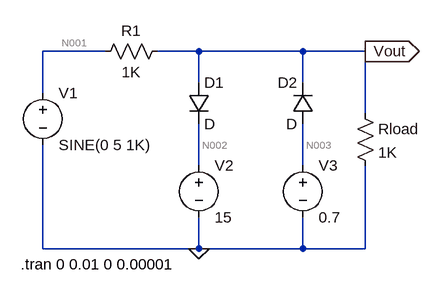
[diagram p0: schematic Draft2.asc]
Draft2.asc, the LTspice schematic file:
Version 4
SHEET 1 880 680
WIRE 288 80 192 80
WIRE 432 80 368 80
WIRE 592 80 432 80
WIRE 688 80 592 80
WIRE 432 128 432 80
WIRE 592 128 592 80
WIRE 192 144 192 80
WIRE 688 176 688 80
WIRE 432 256 432 192
WIRE 592 256 592 192
WIRE 192 384 192 224
WIRE 432 384 432 336
WIRE 432 384 192 384
WIRE 592 384 592 336
WIRE 592 384 432 384
WIRE 688 384 688 256
WIRE 688 384 592 384
FLAG 688 80 Vout
IOPIN 688 80 Out
FLAG 432 384 0
SYMBOL voltage 192 128 R0
WINDOW 123 0 0 Left 2
WINDOW 39 0 0 Left 2
SYMATTR InstName V1
SYMATTR Value SINE(0 5 1K)
SYMBOL voltage 432 240 R0
SYMATTR InstName V2
SYMATTR Value 15
SYMBOL voltage 592 240 R0
SYMATTR InstName V3
SYMATTR Value 0.7
SYMBOL res 384 64 R90
WINDOW 0 0 56 VBottom 2
WINDOW 3 32 56 VTop 2
SYMATTR InstName R1
SYMATTR Value 1K
SYMBOL diode 416 128 R0
SYMATTR InstName D1
SYMBOL diode 608 192 R180
WINDOW 0 24 64 Left 2
WINDOW 3 24 0 Left 2
SYMATTR InstName D2
SYMBOL res 672 160 R0
SYMATTR InstName Rload
SYMATTR Value 1K
TEXT 158 408 Left 2 !.tran 0 0.01 0 0.00001

The netlist it stands for:
* Draft2.asc
V1 N001 0 SINE(0 5 1K)
V2 N002 0 15
V3 N003 0 0.7
R1 Vout N001 1K
D1 Vout N002 D
D2 N003 Vout D
Rload Vout 0 1K
.model D D
.lib standard.dio
.tran 0 0.01 0 0.00001
.backanno
.end

* Results of the author's LTspice run, read from the files saved beside the schematic
* Operating Point, zero values left out:
*   V(n002) = 15 V
*   V(n003) = 700 mV
*   V(vout) = 89.41 mV
*   I(D2) = 178.8 µA
*   I(D1) = -14.92 pA
*   I(Rload) = 89.41 µA
*   I(R1) = 89.41 µA
*   I(V3) = -178.8 µA
*   I(V2) = -14.92 pA
*   I(V1) = 89.41 µA
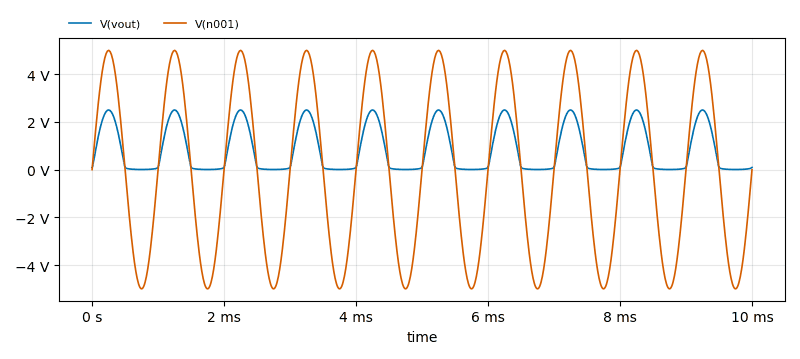
[diagram p1: Transient Analysis of Draft2.asc, plotted from the saved traces]
* Transient Analysis, 1 run:
*   V(vout): min 3.25 mV, max 2.497 V, average 805.6 mV, rms 1.249 V, last 89.39 mV
*   V(n001): min -4.994 V, max 4.994 V, average -1.519 mV, rms 3.532 V, last 0 V